# EAGLE design Boom_hat (EAGLE 6.5.0)
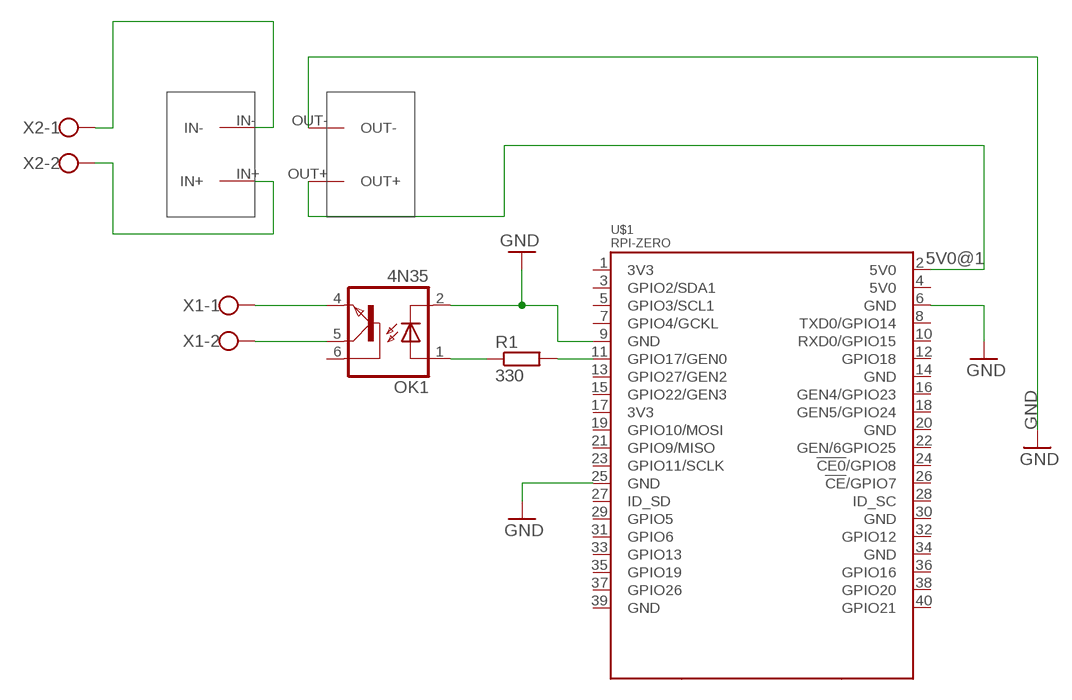
[diagram p0: schematic, sheet 1]

## Parts
OK1  4N35  [DIL06]
R1  330  R-EU_0204/5  [0204/5]
U$1  RPI-ZERO  [RASPBERRYPI_BASTELSTUBE_V13_RASPI_BOARD_B+_FULL]
U$2  DCDC  [DCDC]
X1  W237-102  [W237-102]
X2  W237-102  [W237-102]

## Nets
5V0@1: U$1.2(5V0) U$2.OUT+
GND: OK1.2(C) U$1.6(GND) U$1.9(GND) U$1.25(GND) U$2.OUT-
N$1: R1.2 U$1.11(GPIO17/GEN0)
N$2: OK1.1(A) R1.1
N$3: OK1.5(COL) X1.2
N$4: OK1.4(EMI) X1.1
N$7: U$2.IN- X2.1
N$8: U$2.IN+ X2.2
Unconnected: OK1.6(BAS) U$1.1(3V3) U$1.3(GPIO2/SDA1) U$1.4(5V0) U$1.5(GPIO3/SCL1) U$1.7(GPIO4/GCKL) U$1.8(TXD0/GPIO14) U$1.10(RXD0/GPIO15) U$1.12(GPIO18) U$1.13(GPIO27/GEN2) U$1.14(GND) U$1.15(GPIO22/GEN3) U$1.16(GEN4/GPIO23) U$1.17(3V3) U$1.18(GEN5/GPIO24) U$1.19(GPIO10/MOSI) U$1.20(GND) U$1.21(GPIO9/MISO) U$1.22(GEN/6GPIO25) U$1.23(GPIO11/SCLK) U$1.24(!CE0!/GPIO8) U$1.26(!CE!/GPIO7) U$1.27(ID_SD) U$1.28(ID_SC) U$1.29(GPIO5) U$1.30(GND) U$1.31(GPIO6) U$1.32(GPIO12) U$1.33(GPIO13) U$1.34(GND) U$1.35(GPIO19) U$1.36(GPIO16) U$1.37(GPIO26) U$1.38(GPIO20) U$1.39(GND) U$1.40(GPIO21)

## Library data of the parts
OK1 = optocoupler:4N35: MOTOROLA OPTO COUPLER; MF: FAIRCHILD SEMICONDUCTOR; MPN: 4N35; OC_FARNELL: 1328375; OC_NEWARK: 72K9946
R1 = resistor:R-EU_: RESISTOR, European symbol
U$1 = RPI-Zero:RPI-ZERO
U$2 = dcdc:DCDC
X1 X2 = con-wago-500:W237-102: WAGO SCREW CLAMP; MPN: 237-102; OC_FARNELL: unknown; OC_NEWARK: 70K9898

## Board
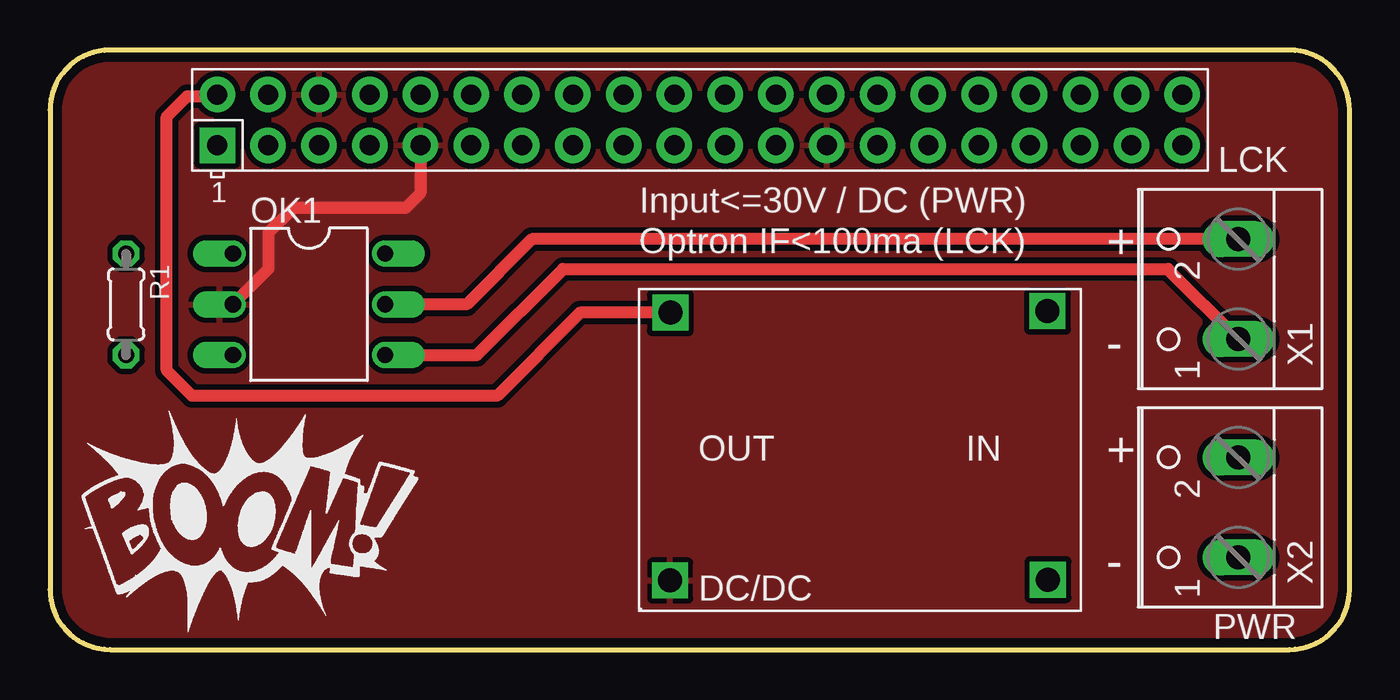
[diagram p1: board, top side]
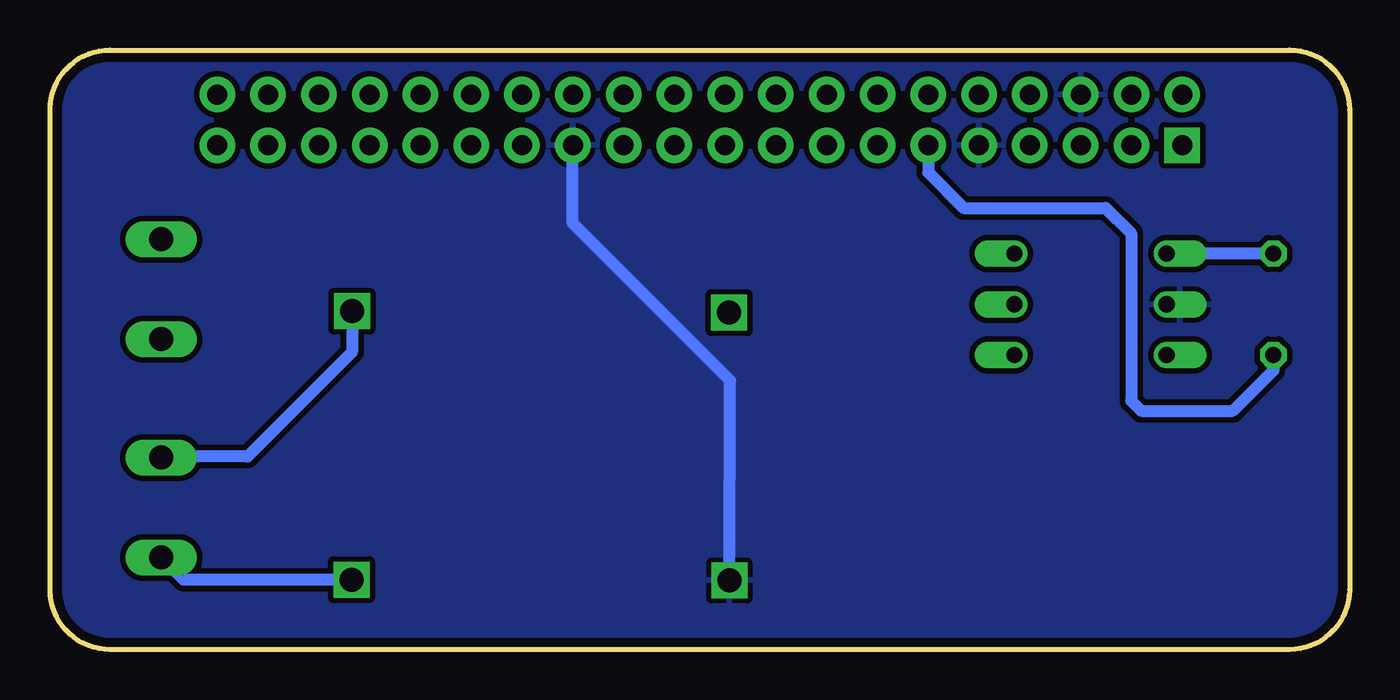
[diagram p2: board, bottom side, seen from below]

Size 65 x 30 mm. Coordinates in mm from the lower left corner, seen from the top.
Copper layers (1*16): Top 0.035mm / dielectric 1.5mm / Bottom 0.035mm
Design rules "default *": minimum track width 10mil, minimum drill 24mil, track to track 11mil, track to pad 11mil, pad to pad 10mil, via to via 10mil, smd to smd 8mil, copper to edge 18mil, drill to drill 14mil, minimum pad ring 10mil, minimum via ring 8mil, stop-mask expansion 4mil, vias tented up to drill 0mil, thermal gap 10mil

### Footprints (pad centres in the part's own frame; a part is rotated, then mirrored left to right if it is on the bottom)
DIL06 = drill 0.813 offset: 1 -2.54,-3.81; 2 0,-3.81; 3 2.54,-3.81; 4 2.54,3.81; 5 0,3.81; 6 -2.54,3.81
0204/5 = drill 0.813 octagon: 1 -2.54,0; 2 2.54,0
RASPBERRYPI_BASTELSTUBE_V13_RASPI_BOARD_B+_FULL = drill 1 pad 1.778 square: 1 8.37,25.23 | drill 1 pad 1.778: 2 8.37,27.77; 3 10.91,25.23; 4 10.91,27.77; 5 13.45,25.23; 6 13.45,27.77; 7 15.99,25.23; 8 15.99,27.77; 9 18.53,25.23; 10 18.53,27.77; 11 21.07,25.23; 12 21.07,27.77; 13 23.61,25.23; 14 23.61,27.77; 15 26.15,25.23; 16 26.15,27.77; 17 28.69,25.23; 18 28.69,27.77; 19 31.23,25.23; 20 31.23,27.77; 21 33.77,25.23; 22 33.77,27.77; 23 36.31,25.23; 24 36.31,27.77; 25 38.85,25.23; 26 38.85,27.77; 27 41.39,25.23; 28 41.39,27.77; 29 43.93,25.23; 30 43.93,27.77; 31 46.47,25.23; 32 46.47,27.77; 33 49.01,25.23; 34 49.01,27.77; 35 51.55,25.23; 36 51.55,27.77; 37 54.09,25.23; 38 54.09,27.77; 39 56.63,25.23; 40 56.63,27.77
DCDC = drill 1.2 square: IN+ 20.43,14.9; IN- 20.45,1.46; OUT+ 1.57,14.82; OUT- 1.55,1.42
W237-102 = drill 1.194 long: 1 -2.5,-1.27; 2 2.5,-1.27

### Placement (x,y rotation side)
OK1  12.95,17.27 270 top
R1  3.81,17.27 270 top
U$1  0,0 0 top
U$2  29.46,2.03 0 top
X1  58.17,18.03 90 top
X2  58.17,7.11 90 top

### Tracks (layer width: path | path; a pad name or v marks a point on that pad's centre or on a via)
5V0@1
  Top 0.61: U$1.2 8.29,27.69 6.86,27.69 5.84,26.67 5.84,13.97 7.11,12.7 22.35,12.7 26.5,16.85 U$2.OUT+
GND
  Top 0.61: U$1.9 18.53,22.85 17.78,22.1 12.19,22.1 10.92,20.83 10.92,19.05 OK1.2
  Bottom 0.61: 38.86,25.22 38.86,21.34 30.98,13.46 U$2.OUT-
  pour Bottom: 3.05,29.72 61.72,29.72 arc-90 64.77,26.67 64.77,3.05 arc-90 61.98,0.25 2.79,0.25 arc-90 0.25,2.79 0.25,26.92 arc-90
  pour Top: 3.05,29.72 61.98,29.72 arc-90 64.77,26.92 64.77,3.05 arc-90 61.98,0.25 2.79,0.25 arc-90 0.25,2.79 0.25,26.92 arc-90
N$1
  Bottom 0.61: R1.2 3.81,13.97 5.84,11.94 10.41,11.94 10.92,12.45 10.92,20.83 12.19,22.1 19.3,22.1 21.07,23.86 U$1.11
N$2
  Bottom 0.61: R1.1 OK1.1
N$3
  Top 0.61: X1.2 24.09,20.53 20.83,17.27 OK1.5
N$4
  Top 0.61: OK1.4 21.34,14.73 25.65,19.05 55.92,19.05 X1.1
N$7
  Bottom 0.61: U$2.IN- 58.32,3.49 X2.1
N$8
  Bottom 0.61: U$2.IN+ 49.89,14.88 55.12,9.65 59.4,9.65 X2.2

### Text on the board
tNames: LCK | Input<=30V / DC (PWR) | Optron IF<100ma (LCK) | + | - | + | - | PWR